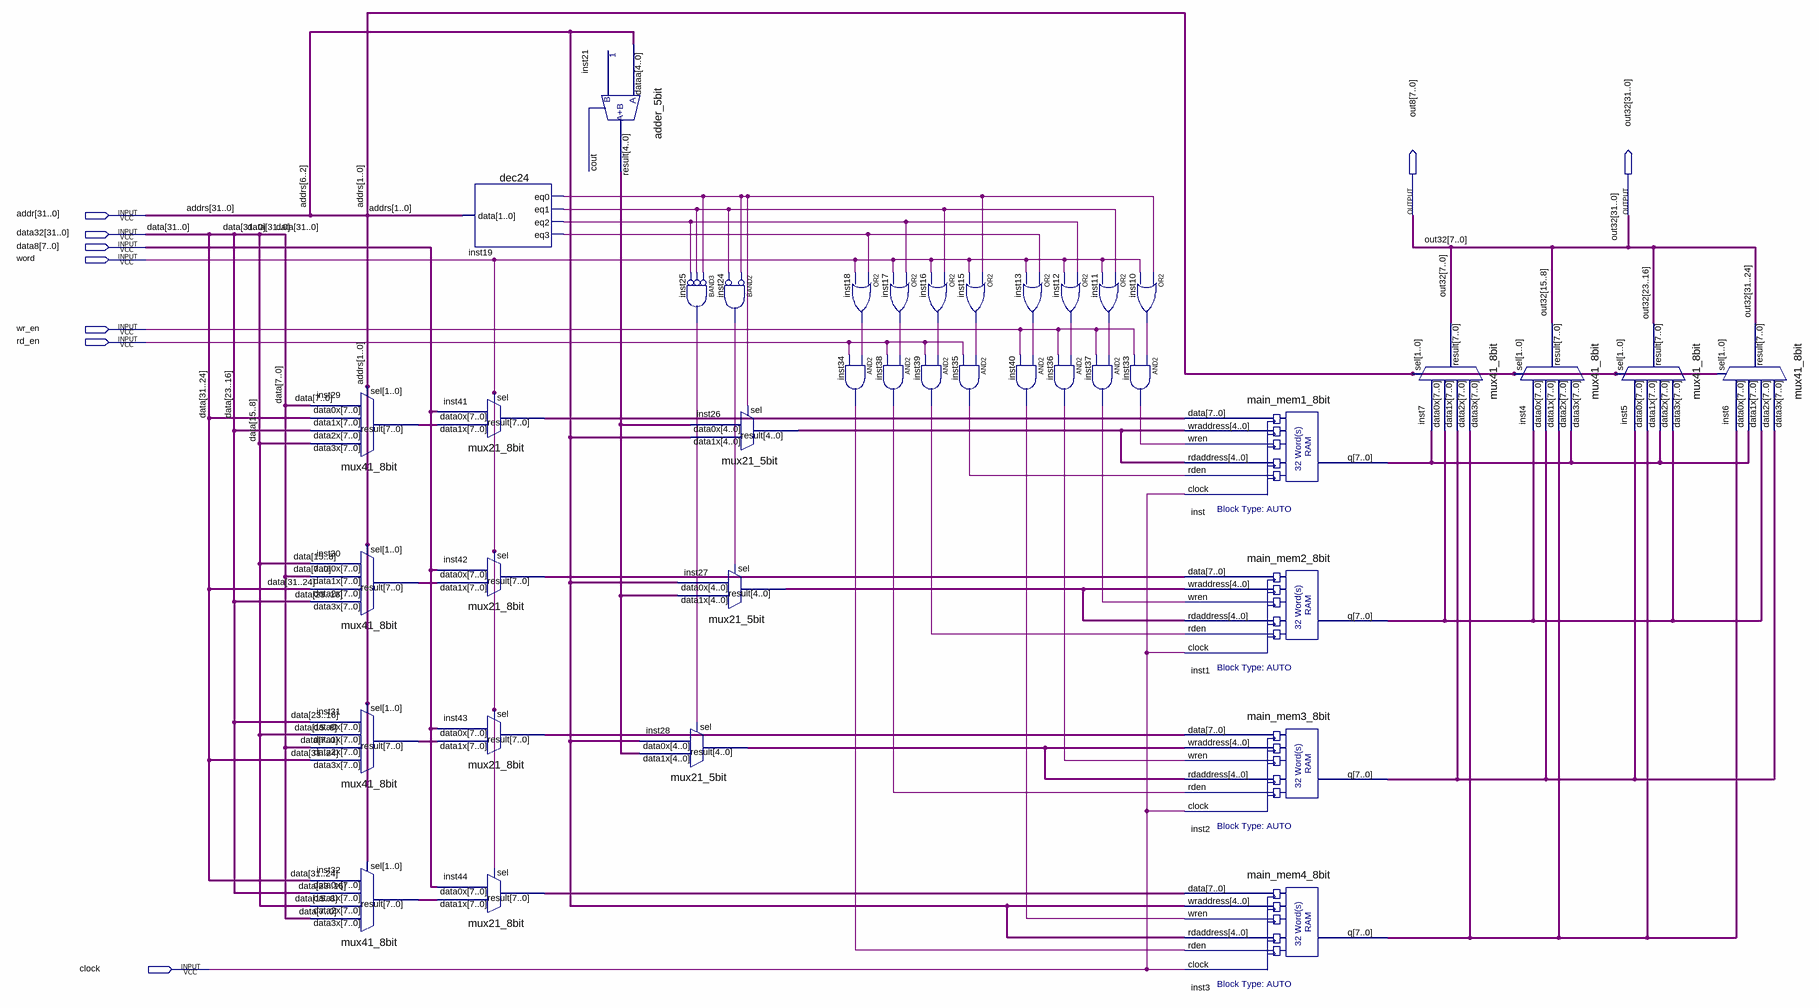
[diagram p0: schematic sheet]
// Quartus schematic main_mem.bdf as structural Verilog: 39 symbols, 9 pins
module main_mem (
  input  [31:0] addr,
  input  [31:0] data32,
  input  [7:0] data8,
  input  word,
  input  wr_en,
  input  rd_en,
  input  clock,
  output [7:0] out8,
  output [31:0] out32
);

  wire inst10_out, inst11_out, inst12_out, inst13_out, inst15_out, inst16_out, inst17_out, inst18_out,
       inst19_eq0, inst19_eq1, inst19_eq2, inst19_eq3, inst24_out, inst25_out, inst33_out, inst34_out,
       inst35_out, inst36_out, inst37_out, inst38_out, inst39_out, inst40_out;
  wire [4:0] inst21_result, inst26_result, inst27_result, inst28_result;
  wire [7:0] inst1_q, inst2_q, inst3_q, inst29_result, inst30_result, inst31_result, inst32_result,
       inst41_result, inst42_result, inst43_result, inst44_result, inst_q;

  mux41_8bit inst29 (
    .data3x(data32[15:8]), .data2x(data32[23:16]), .data1x(data32[31:24]), .data0x(data32[7:0]),
    .sel(addr[1:0]), .result(inst29_result));
  mux41_8bit inst30 (
    .data3x(data32[23:16]), .data2x(data32[31:24]), .data1x(data32[7:0]), .data0x(data32[15:8]),
    .sel(addr[1:0]), .result(inst30_result));
  mux41_8bit inst31 (
    .data3x(data32[31:24]), .data2x(data32[7:0]), .data1x(data32[15:8]), .data0x(data32[23:16]),
    .sel(addr[1:0]), .result(inst31_result));
  mux41_8bit inst32 (
    .data3x(data32[7:0]), .data2x(data32[15:8]), .data1x(data32[23:16]), .data0x(data32[31:24]),
    .sel(addr[1:0]), .result(inst32_result));
  mux21_8bit inst41 (.data1x(inst29_result), .data0x(data8), .sel(word), .result(inst41_result));
  mux21_8bit inst42 (.data1x(inst30_result), .data0x(data8), .sel(word), .result(inst42_result));
  mux21_8bit inst43 (.data1x(inst31_result), .data0x(data8), .sel(word), .result(inst43_result));
  mux21_8bit inst44 (.data1x(inst32_result), .data0x(data8), .sel(word), .result(inst44_result));
  dec24 inst19 (.data(addr[1:0]), .eq0(inst19_eq0), .eq1(inst19_eq1), .eq2(inst19_eq2), .eq3(inst19_eq3));
  adder_5bit inst21 (.dataa(addr[6:2]), .result(inst21_result));  // open: cout
  mux21_5bit inst28 (.data1x(inst21_result), .data0x(addr[6:2]), .sel(inst25_out), .result(inst28_result));
  and inst25 (inst25_out, ~inst19_eq0, ~inst19_eq1, ~inst19_eq2);  // BAND3
  mux21_5bit inst26 (.data1x(addr[6:2]), .data0x(inst21_result), .sel(inst19_eq0), .result(inst26_result));
  mux21_5bit inst27 (.data1x(inst21_result), .data0x(addr[6:2]), .sel(inst24_out), .result(inst27_result));
  and inst24 (inst24_out, ~inst19_eq0, ~inst19_eq1);  // BAND2
  or inst18 (inst18_out, inst19_eq3, word);
  and inst34 (inst34_out, inst18_out, rd_en);
  or inst17 (inst17_out, inst19_eq2, word);
  and inst38 (inst38_out, inst17_out, rd_en);
  or inst16 (inst16_out, inst19_eq1, word);
  and inst35 (inst35_out, inst15_out, rd_en);
  and inst39 (inst39_out, inst16_out, rd_en);
  or inst15 (inst15_out, inst19_eq0, word);
  or inst12 (inst12_out, inst19_eq2, word);
  or inst13 (inst13_out, inst19_eq3, word);
  and inst36 (inst36_out, inst12_out, wr_en);
  and inst40 (inst40_out, inst13_out, wr_en);
  or inst11 (inst11_out, inst19_eq1, word);
  and inst37 (inst37_out, inst11_out, wr_en);
  or inst10 (inst10_out, inst19_eq0, word);
  and inst33 (inst33_out, inst10_out, wr_en);
  main_mem1_8bit inst (
    .data(inst41_result), .wraddress(inst26_result), .wren(inst33_out), .rdaddress(inst26_result),
    .rden(inst35_out), .clock(clock), .q(inst_q));
  main_mem2_8bit inst1 (
    .data(inst42_result), .wraddress(inst27_result), .wren(inst37_out), .rdaddress(inst27_result),
    .rden(inst39_out), .clock(clock), .q(inst1_q));
  main_mem3_8bit inst2 (
    .data(inst43_result), .wraddress(inst28_result), .wren(inst36_out), .rdaddress(inst28_result),
    .rden(inst38_out), .clock(clock), .q(inst2_q));
  main_mem4_8bit inst3 (
    .data(inst44_result), .wraddress(addr[6:2]), .wren(inst40_out), .rdaddress(addr[6:2]), .rden(inst34_out),
    .clock(clock), .q(inst3_q));
  mux41_8bit inst7 (
    .data3x(inst3_q), .data2x(inst2_q), .data1x(inst1_q), .data0x(inst_q), .sel(addr[1:0]), .result(out8));
  mux41_8bit inst4 (
    .data3x(inst_q), .data2x(inst3_q), .data1x(inst2_q), .data0x(inst1_q), .sel(addr[1:0]),
    .result(out32[15:8]));
  mux41_8bit inst5 (
    .data3x(inst1_q), .data2x(inst_q), .data1x(inst3_q), .data0x(inst2_q), .sel(addr[1:0]),
    .result(out32[23:16]));
  mux41_8bit inst6 (
    .data3x(inst2_q), .data2x(inst1_q), .data1x(inst_q), .data0x(inst3_q), .sel(addr[1:0]),
    .result(out32[31:24]));

  assign out32[7:0] = out8;

  // Other names for the same wires on the sheet: addrs[31:0] = addr; data[31:0] = data32
endmodule
